# EAGLE schematic emu (EAGLE 6.1)
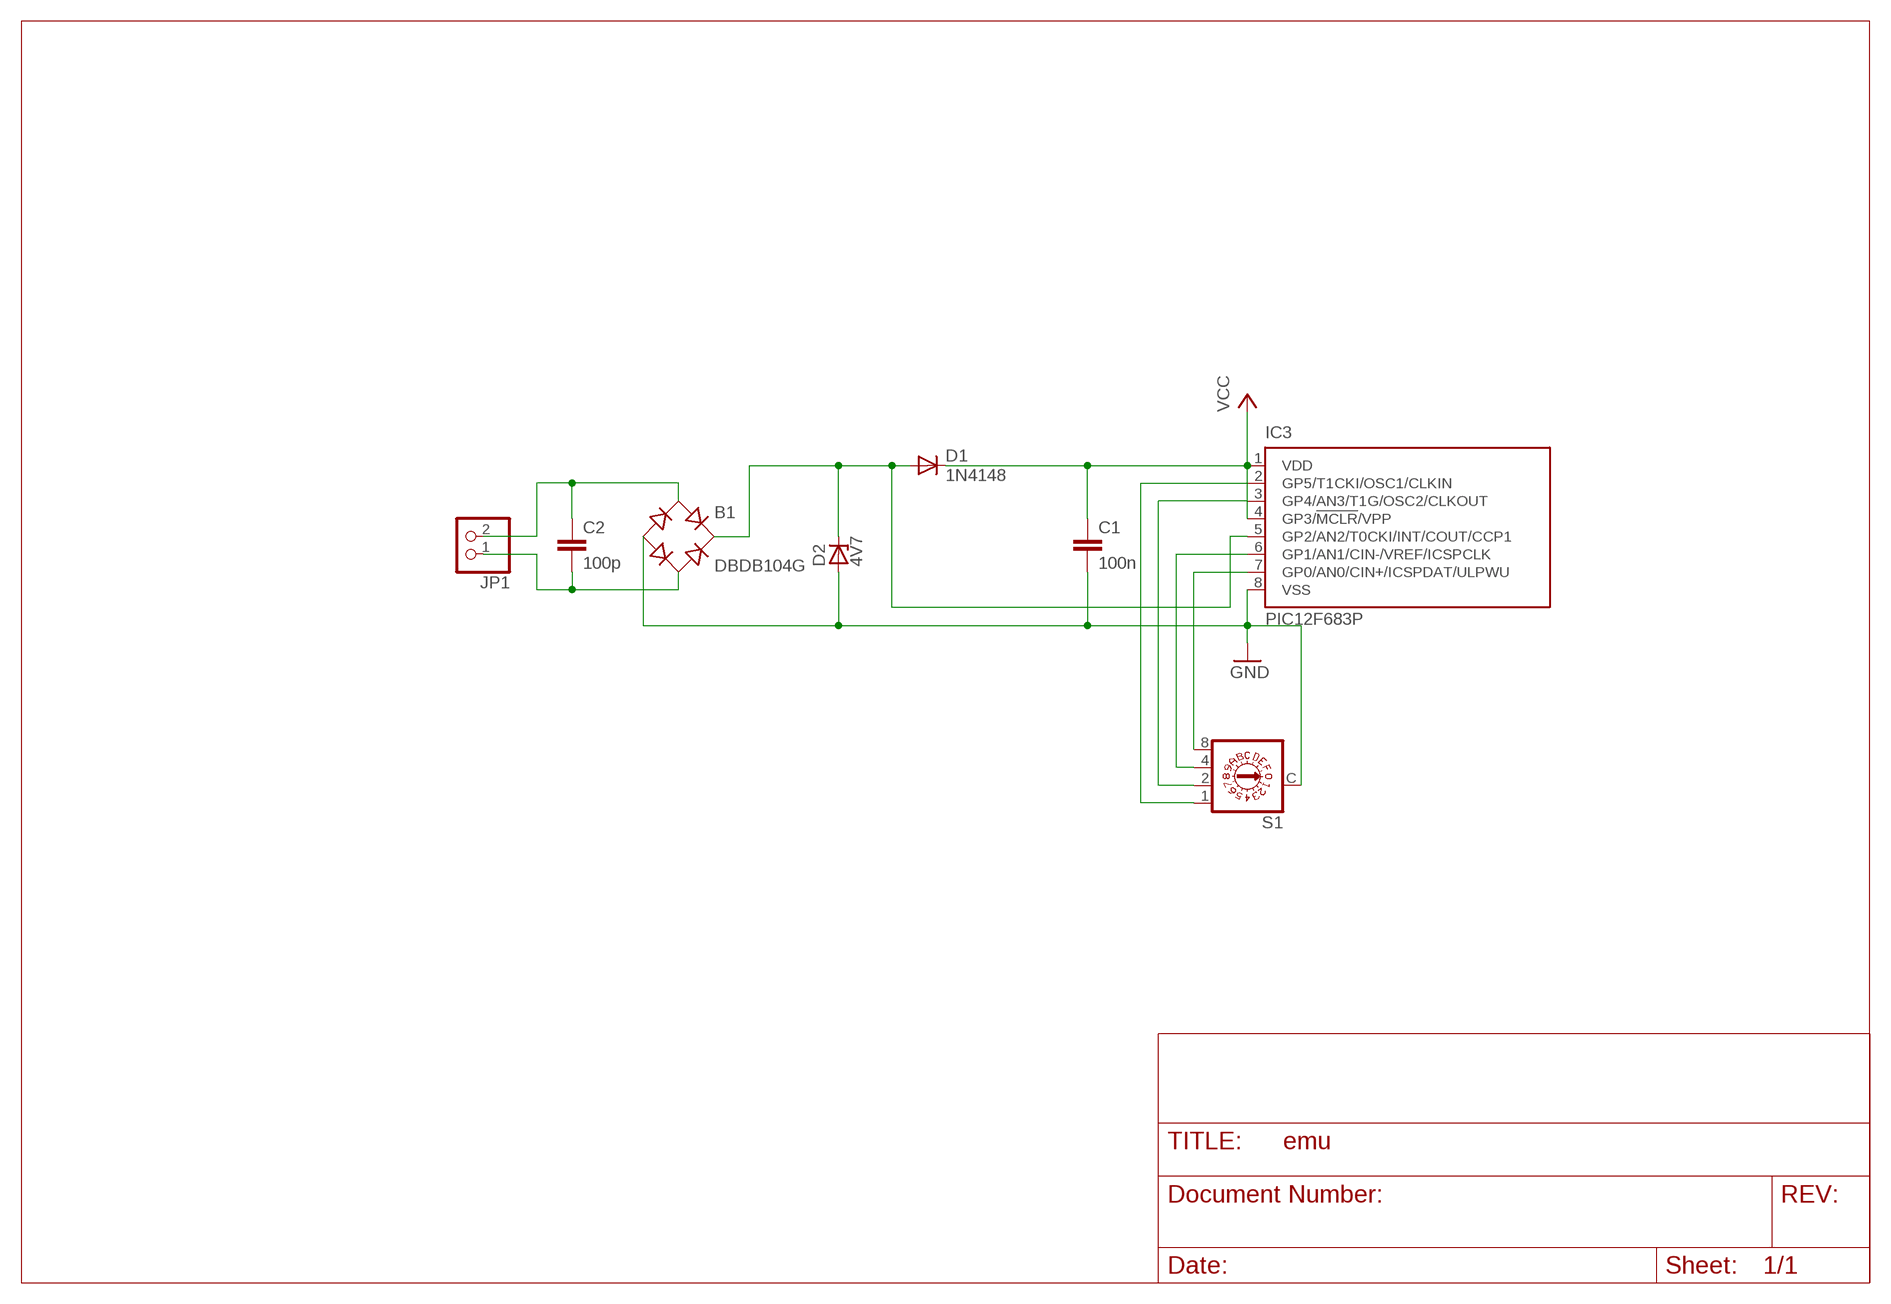
[diagram p0: schematic, sheet 1]

## Parts
B1  DBDB104G  [DB]
C1  100n  C-EU025-025X050  [C025-025X050]
C2  100p  C-EU025-025X050  [C025-025X050]
D1  1N4148  1N4148DO35-7  [DO35-7]
D2  4V7  ZENER-DIODEZD-5  [ZDIO-5]
IC3  PIC12F683P  [DIL8]
JP1  PINHD-1X2/90  [1X02/90]
S1  S10HEX  [S10HEX]

## Nets
GND: B1.- C1.2 D2.A IC3.8(VSS) S1.C
N$1: B1.AC2 C2.2 JP1.1
N$2: B1.AC1 C2.1 JP1.2
N$3: B1.+ D1.A D2.C IC3.5(GP2/AN2/T0CKI/INT/COUT/CCP1)
N$5: IC3.7(GP0/AN0/CIN+/ICSPDAT/ULPWU) S1.8
N$6: IC3.6(GP1/AN1/CIN-/VREF/ICSPCLK) S1.4
N$7: IC3.3(GP4/AN3/T1G/OSC2/CLKOUT) S1.2
N$8: IC3.2(GP5/T1CKI/OSC1/CLKIN) S1.1
VCC: C1.1 D1.C IC3.1(VDD) IC3.4(GP3/!MCLR!/VPP)

## Library data of the parts
B1 = rectifier:DB?*G: Single Phase 1.0 AMP Glass Passivated Bridge Rectifier Taiwan Semiconductor Co.,Ltd. - TSC Source: http://www.taiwansemi.com/TSCbig5/ezcatfiles/cust/img/img/db101g.pdf http://www.ts.com.tw/db/pictures/modules/PDT/PDT060207001/DBLS201G.pdf
C1 C2 = rcl:C-EU: CAPACITOR, European symbol
D1 = diode:1N4148: DIODE high speed (Philips)
D2 = diode:ZENER-DIODE: Z-Diode
IC3 = microchip:PIC12F683: 8-Pin Flash-Based, 8-Bit CMOS Microcontrollers with nanoWatt Technology Source: http://ww1.microchip.com/downloads/en/DeviceDoc/41211D_.pdf; MF: MICROCHIP; MPN: PIC12F683-I/P; OC_FARNELL: 9759034; OC_NEWARK: 89H0442
JP1 = pinhead:PINHD-1X2: PIN HEADER
S1 = switch-dil:S10HEX: DIL/CODE SWITCH; OC_FARNELL: unknown; OC_NEWARK: unknown